# EAGLE design V1 (EAGLE 7.6.0)
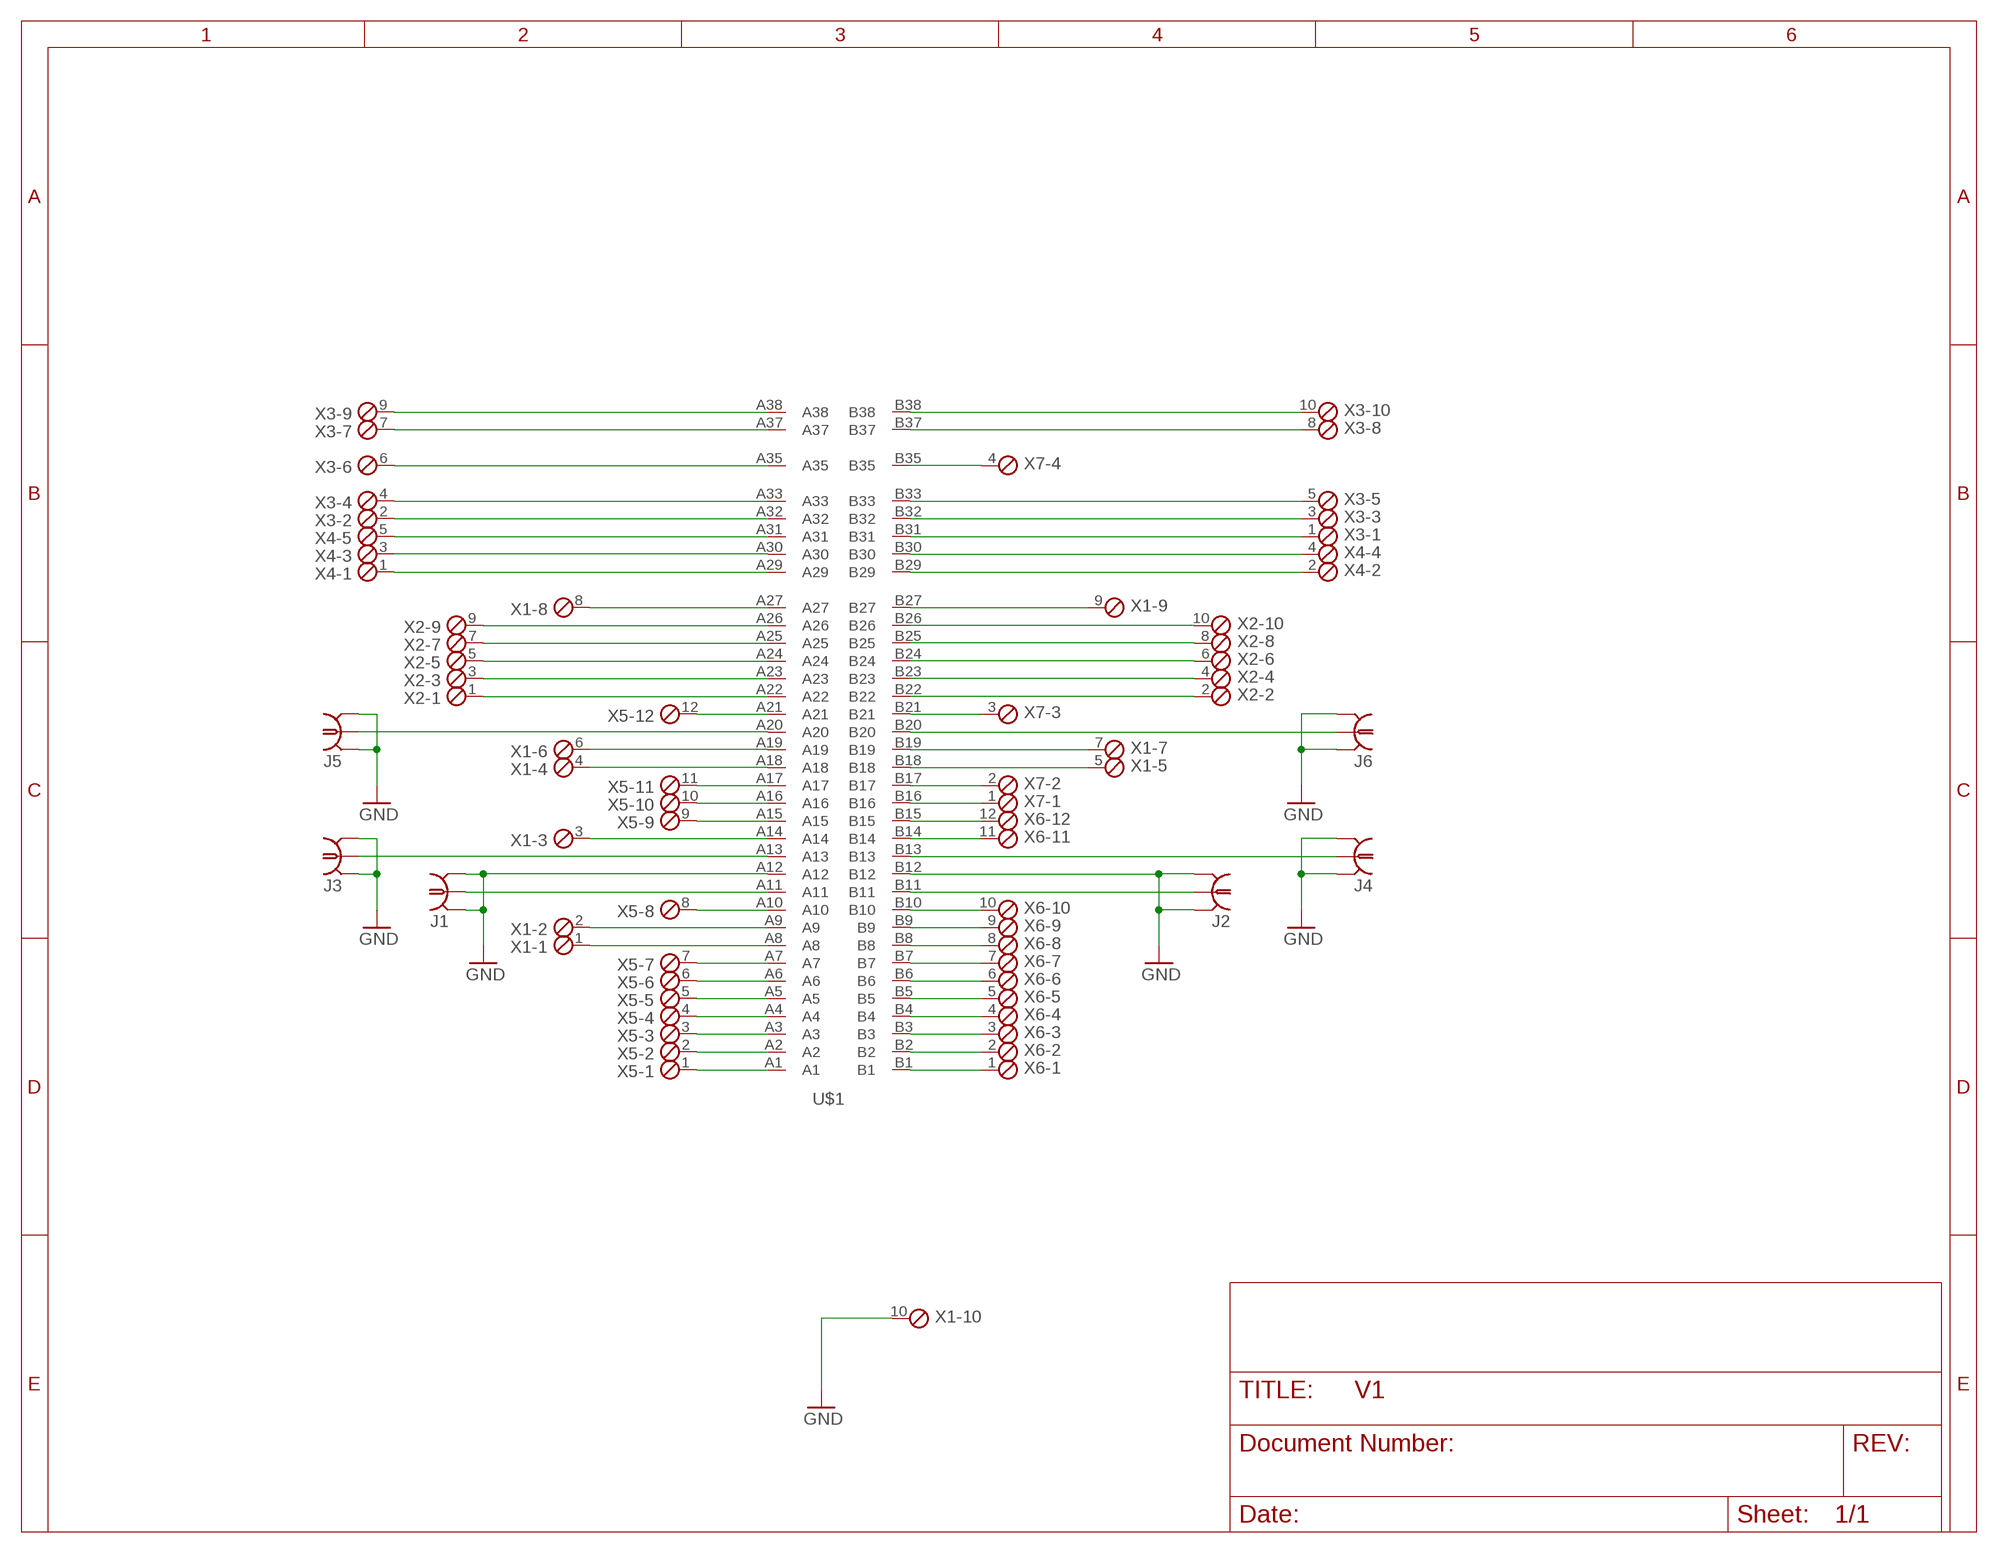
[diagram p0: schematic, sheet 1]

## Parts
J1  BNC_MOLEX_73100  [73100]
J2  BNC_MOLEX_73100  [73100]
J3  BNC_MOLEX_73100  [73100]
J4  BNC_MOLEX_73100  [73100]
J5  BNC_MOLEX_73100  [73100]
J6  BNC_MOLEX_73100  [73100]
U$1  TEK_7000  [TEK_7000]
X1  MPT10  [10POL254]
X2  MPT10  [10POL254]
X3  MPT10  [10POL254]
X4  MPT5  [5POL254]
X5  MPT12  [12POL254]
X6  MPT12  [12POL254]
X7  MPT4  [4POL254]

## Nets
GND: J1.GND J1.GND@1(GND) J2.GND J2.GND@1(GND) J3.GND J3.GND@1(GND) J4.GND J4.GND@1(GND) J5.GND J5.GND@1(GND) J6.GND J6.GND@1(GND) U$1.A12 U$1.B12 X1.10
N$1: U$1.A1 X5.1
N$2: U$1.A2 X5.2
N$3: U$1.A3 X5.3
N$4: U$1.A4 X5.4
N$5: U$1.A5 X5.5
N$6: U$1.A6 X5.6
N$7: U$1.A7 X5.7
N$8 [Power]: U$1.A8 X1.1
N$9 [Power]: U$1.A9 X1.2
N$10: U$1.A10 X5.8
N$11 [50Ohm]: J1.SIG U$1.A11
N$12 [50Ohm]: J3.SIG U$1.A13
N$13 [Power]: U$1.A14 X1.3
N$14: U$1.A15 X5.9
N$15: U$1.A16 X5.10
N$16: U$1.A17 X5.11
N$17: U$1.B1 X6.1
N$18: U$1.B2 X6.2
N$19: U$1.B3 X6.3
N$20: U$1.B4 X6.4
N$21: U$1.B5 X6.5
N$22: U$1.B6 X6.6
N$23: U$1.B7 X6.7
N$24: U$1.B8 X6.8
N$25: U$1.B9 X6.9
N$26: U$1.B10 X6.10
N$27 [50Ohm]: J2.SIG U$1.B11
N$28 [50Ohm]: J4.SIG U$1.B13
N$29: U$1.B14 X6.11
N$30: U$1.B15 X6.12
N$31: U$1.B16 X7.1
N$32: U$1.B17 X7.2
N$33 [Power]: U$1.B18 X1.5
N$34 [Power]: U$1.B19 X1.7
N$35 [Power]: U$1.A18 X1.4
N$36 [Power]: U$1.A19 X1.6
N$37 [50Ohm]: J6.SIG U$1.B20
N$38 [50Ohm]: J5.SIG U$1.A20
N$39: U$1.A21 X5.12
N$40: U$1.B21 X7.3
N$41 [Power]: U$1.A27 X1.8
N$42 [Power]: U$1.B27 X1.9
N$43: U$1.A26 X2.9
N$44: U$1.A25 X2.7
N$45: U$1.A24 X2.5
N$46: U$1.A23 X2.3
N$47: U$1.A22 X2.1
N$48: U$1.B26 X2.10
N$49: U$1.B25 X2.8
N$50: U$1.B24 X2.6
N$51: U$1.B23 X2.4
N$52: U$1.B22 X2.2
N$53: U$1.B35 X7.4
N$54: U$1.A29 X4.1
N$55: U$1.A30 X4.3
N$56: U$1.A31 X4.5
N$57: U$1.A32 X3.2
N$58: U$1.A33 X3.4
N$59: U$1.A35 X3.6
N$60: U$1.A37 X3.7
N$61: U$1.A38 X3.9
N$62: U$1.B38 X3.10
N$63: U$1.B37 X3.8
N$64: U$1.B31 X3.1
N$65: U$1.B32 X3.3
N$66: U$1.B33 X3.5
N$67: U$1.B30 X4.4
N$68: U$1.B29 X4.2

## Library data of the parts
J1-J6 = AndyW:BNC_MOLEX_73100: MOLEX RA PCB mount BNC Origin alignes with board edge.
U$1 = AndyW:TEK_7000: Tek 7000 plug-in connector 76 pin, 0.1", dual-sided. A & B sides, 1-38 each. Omit: [AB][28,34,36] as per manual. Origin aligned to lower left corner of 3.9" high PCB.
X1-X3 = con-phoenix-254:MPT10: PHOENIX CONNECTOR; OC_FARNELL: unknown; OC_NEWARK: unknown
X4 = con-phoenix-254:MPT5: PHOENIX CONNECTOR; OC_FARNELL: unknown; OC_NEWARK: unknown
X5 X6 = con-phoenix-254:MPT12: PHOENIX CONNECTOR; OC_FARNELL: unknown; OC_NEWARK: unknown
X7 = con-phoenix-254:MPT4: PHOENIX CONNECTOR; OC_FARNELL: unknown; OC_NEWARK: unknown

## Net classes
0 default: width 0.203 mm, drill 0.254 mm, clearance 0.152 mm
1 50Ohm: width 0.406 mm, drill 0.254 mm, clearance 0.254 mm
2 Power: width 1.016 mm, drill 0.254 mm, clearance 0.508 mm

## Board
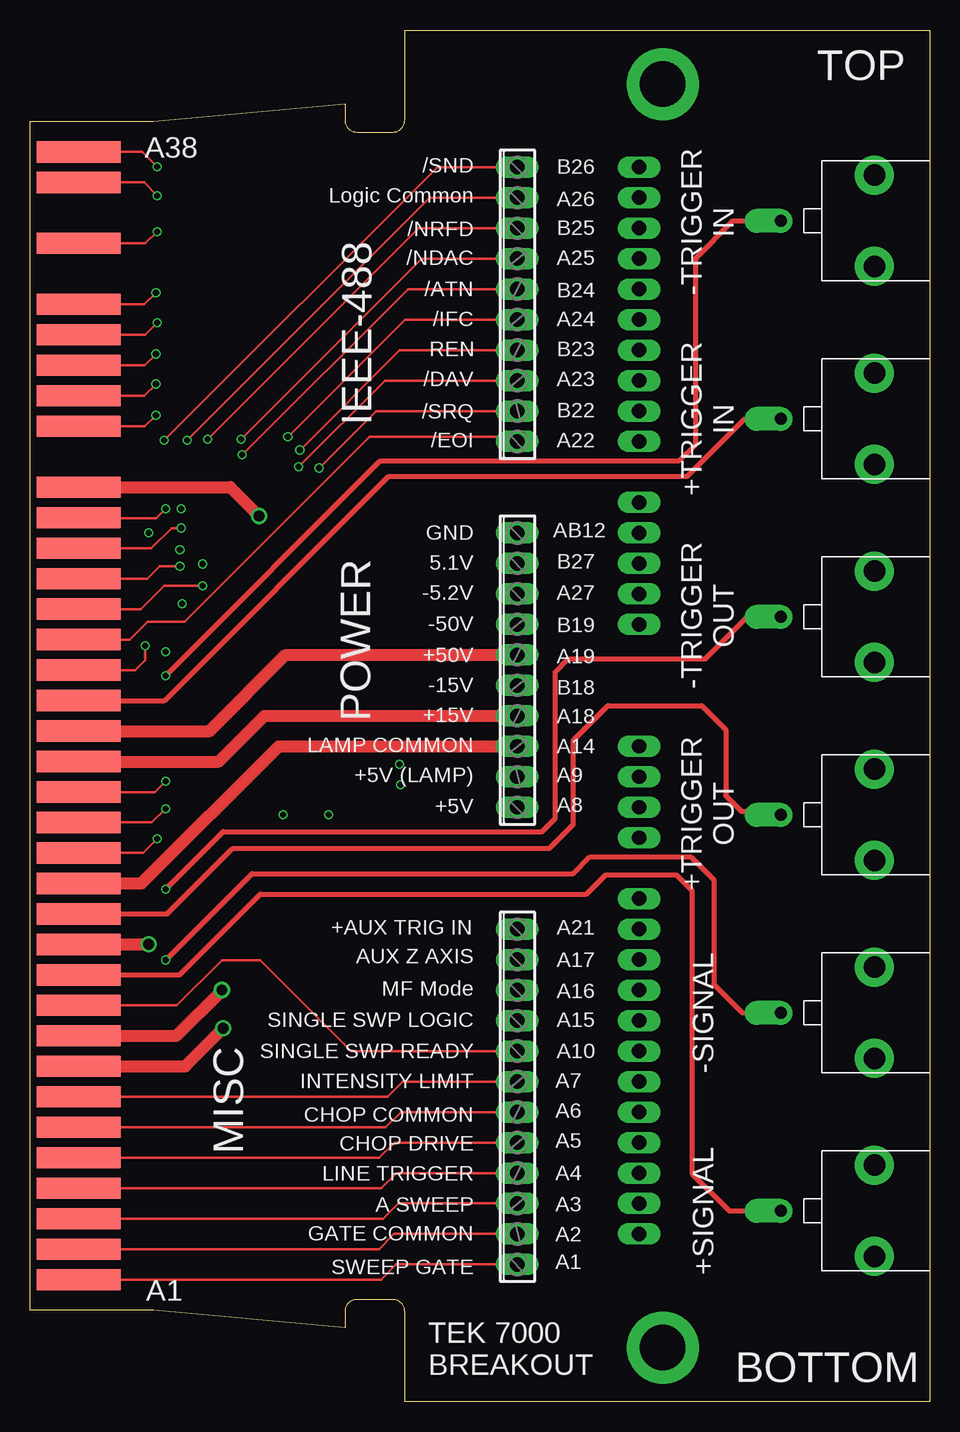
[diagram p1: board, top side]
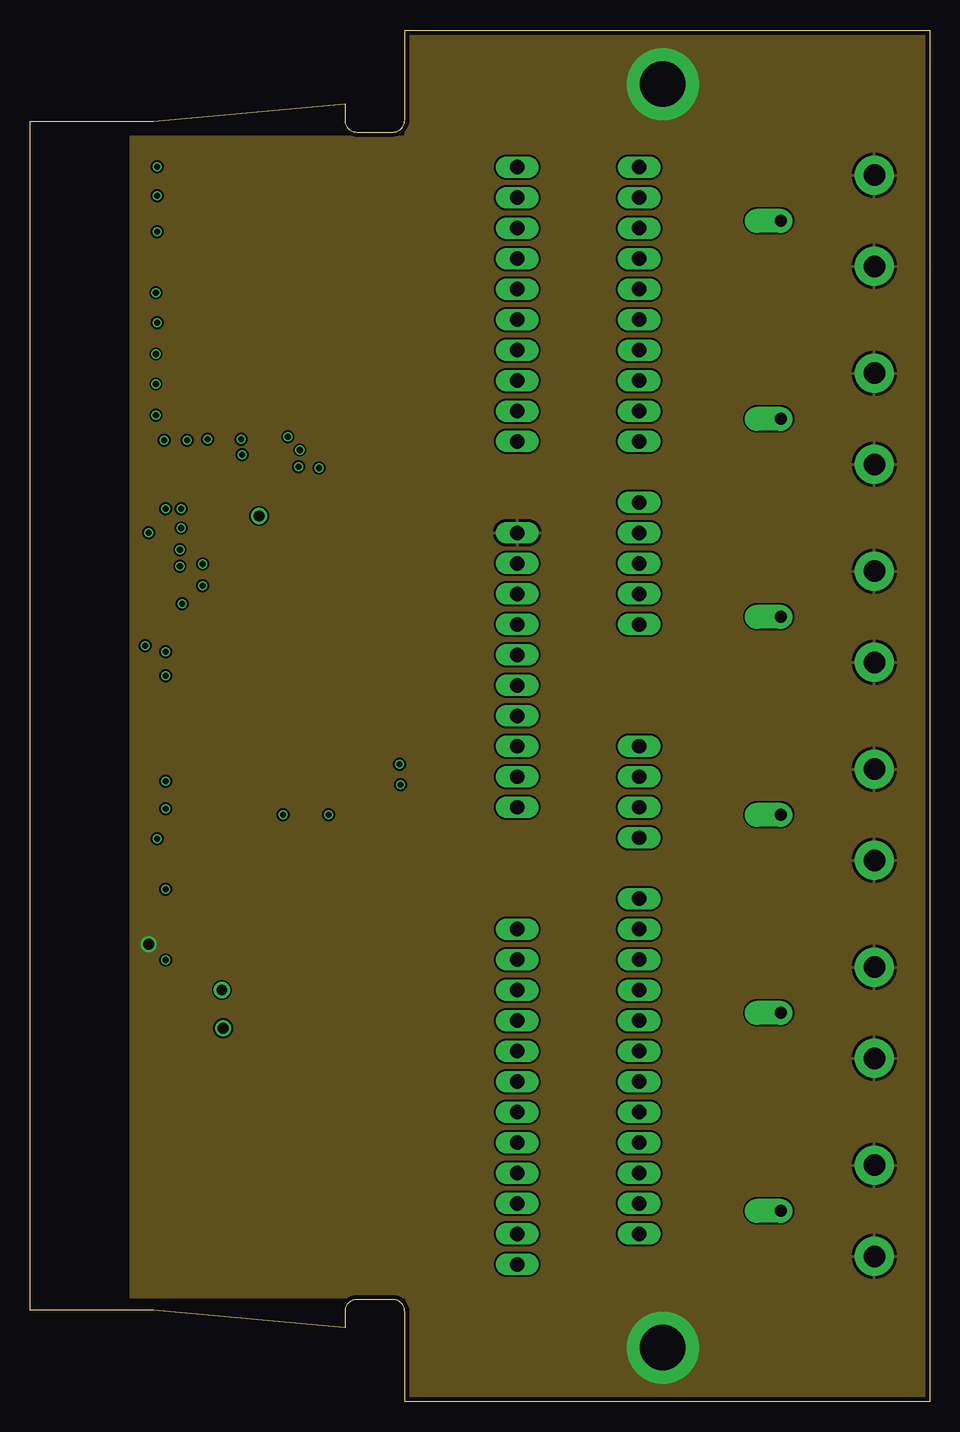
[diagram p2: board, inner layer Route2]
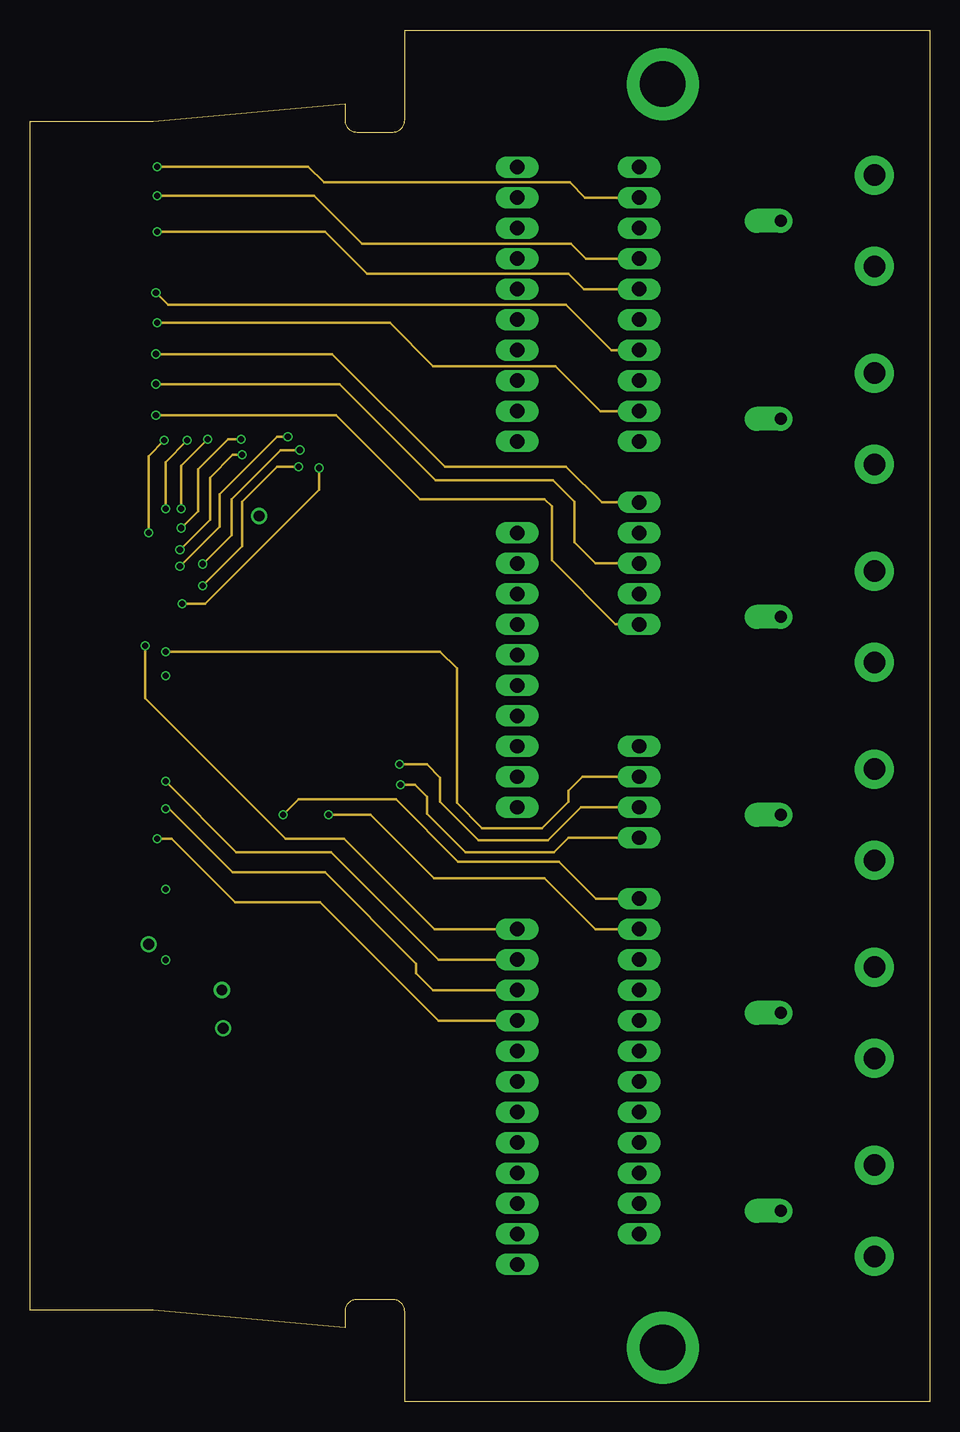
[diagram p3: board, inner layer Route15]
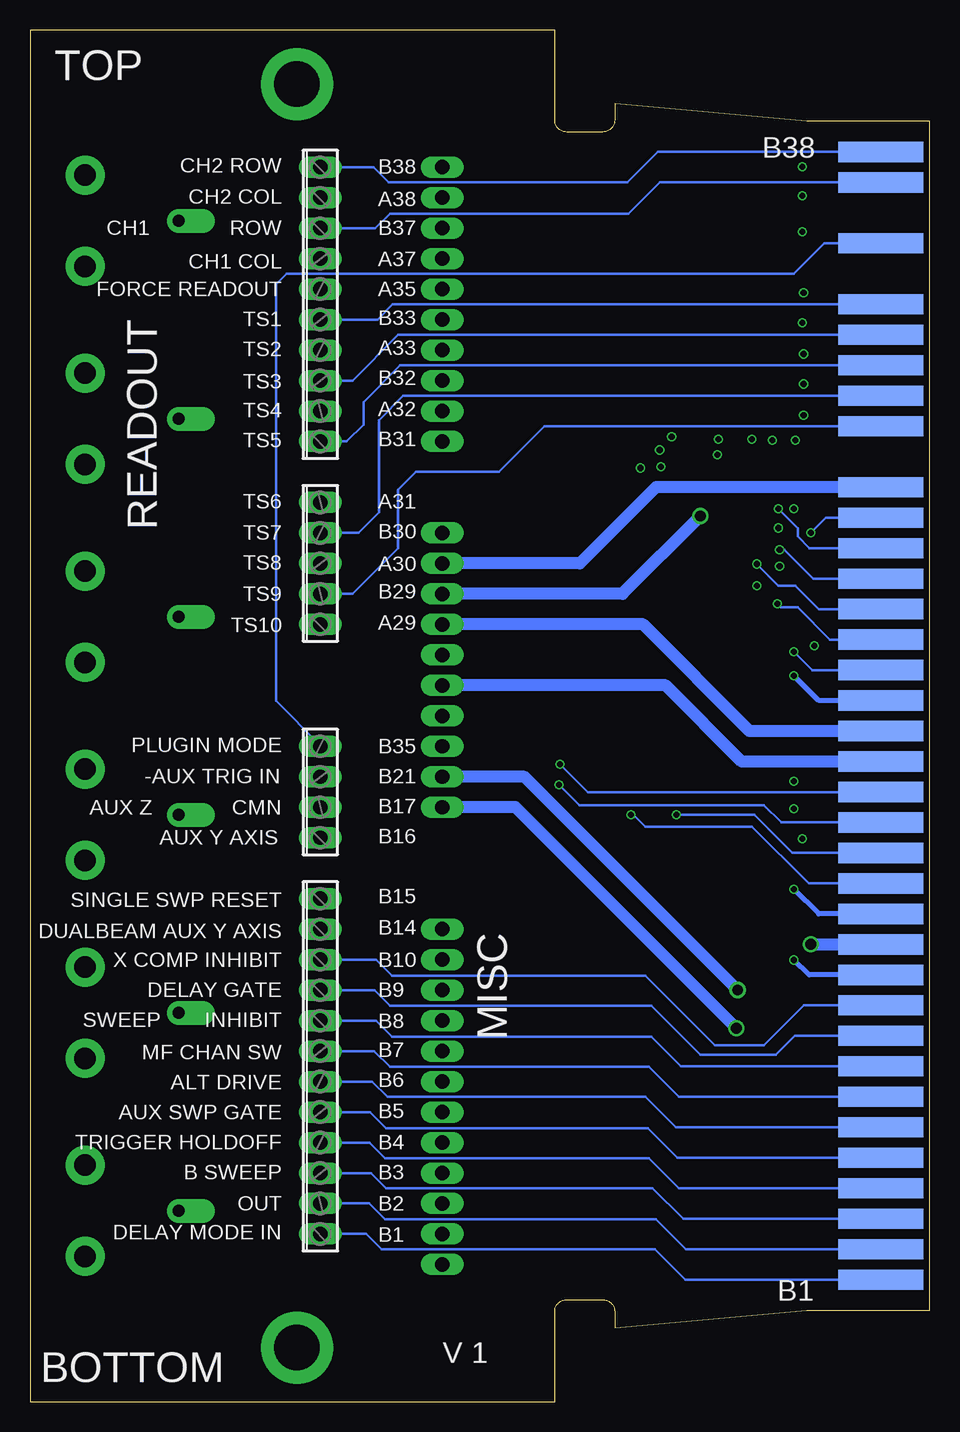
[diagram p4: board, bottom side, seen from below]

Size 75 x 114.3 mm. Coordinates in mm from the lower left corner, seen from the top.
Outline: 0,7.62 0,106.68 10.25,106.68 26.25,108.15 26.25,106.8 arc90 27.25,105.8 30.25,105.8 arc90 31.25,106.8 31.25,114.3 75,114.3 75,0 31.25,0 31.25,7.5 arc90 30.25,8.5 27.25,8.5 arc90 26.25,7.5 26.25,6.15 10.25,7.62 0,7.62
Copper layers (1*2*15*16): Top 0.035559375mm / dielectric 0.17018125mm / Route2 0.01778125mm / dielectric 47mil / Route15 0.01778125mm / dielectric 0.17018125mm / Bottom 0.035559375mm
Design rules "oshpark-4layer": minimum track width 5mil, minimum drill 10mil, track to track 5mil, track to pad 5mil, pad to pad 5mil, via to via 5mil, smd to smd 5mil, copper to edge 15mil, drill to drill 6mil, minimum pad ring 4mil, minimum via ring 4mil, stop-mask expansion 2.5mil, vias tented up to drill 0mil, thermal gap 10mil

### Footprints (pad centres in the part's own frame; a part is rotated, then mirrored left to right if it is on the bottom)
73100 = drill 1.8 pad 3.25: GND -4.6,-3.8; GND@1 -4.6,3.8 | drill 1 pad 2 offset: SIG -12.4,0
TEK_7000 = smd 7.112 x 1.778: A1 4.064,2.54; A2 4.064,5.08; A3 4.064,7.62; A4 4.064,10.16; A5 4.064,12.7; A6 4.064,15.24; A7 4.064,17.78; A8 4.064,20.32; A9 4.064,22.86; A10 4.064,25.4; A11 4.064,27.94; A12 4.064,30.48; A13 4.064,33.02; A14 4.064,35.56; A15 4.064,38.1; A16 4.064,40.64; A17 4.064,43.18; A18 4.064,45.72; A19 4.064,48.26; A20 4.064,50.8; A21 4.064,53.34; A22 4.064,55.88; A23 4.064,58.42; A24 4.064,60.96; A25 4.064,63.5; A26 4.064,66.04; A27 4.064,68.58; A29 4.064,73.66; A30 4.064,76.2; A31 4.064,78.74; A32 4.064,81.28; A33 4.064,83.82; A35 4.064,88.9; A37 4.064,93.98; A38 4.064,96.52 | smd 7.112 x 1.778 bottom: B1 4.064,2.54; B2 4.064,5.08; B3 4.064,7.62; B4 4.064,10.16; B5 4.064,12.7; B6 4.064,15.24; B7 4.064,17.78; B8 4.064,20.32; B9 4.064,22.86; B10 4.064,25.4; B11 4.064,27.94; B12 4.064,30.48; B13 4.064,33.02; B14 4.064,35.56; B15 4.064,38.1; B16 4.064,40.64; B17 4.064,43.18; B18 4.064,45.72; B19 4.064,48.26; B20 4.064,50.8; B21 4.064,53.34; B22 4.064,55.88; B23 4.064,58.42; B24 4.064,60.96; B25 4.064,63.5; B26 4.064,66.04; B27 4.064,68.58; B29 4.064,73.66; B30 4.064,76.2; B31 4.064,78.74; B32 4.064,81.28; B33 4.064,83.82; B35 4.064,88.9; B37 4.064,93.98; B38 4.064,96.52
10POL254 = drill 1.2 long: 1 -11.43,0; 2 -8.89,0; 3 -6.35,0; 4 -3.81,0; 5 -1.27,0; 6 1.27,0; 7 3.81,0; 8 6.35,0; 9 8.89,0; 10 11.43,0
5POL254 = drill 1.2 long: 1 -5.08,0; 2 -2.54,0; 3 0,0; 4 2.54,0; 5 5.08,0
12POL254 = drill 1.2 long: 1 -13.97,0; 2 -11.43,0; 3 -8.89,0; 4 -6.35,0; 5 -3.81,0; 6 -1.27,0; 7 1.27,0; 8 3.81,0; 9 6.35,0; 10 8.89,0; 11 11.43,0; 12 13.97,0
4POL254 = drill 1.2 long: 1 -3.81,0; 2 -1.27,0; 3 1.27,0; 4 3.81,0

### Placement (x,y rotation side)
J1  75,15.9 0 top
J2  75,32.4 0 top
J3  75,48.9 0 top
J4  75,65.4 0 top
J5  75,81.9 0 top
J6  75,98.4 0 top
U$1  0,7.62 0 top
X1  40.64,60.96 90 top
X2  40.64,91.44 90 top
X3  50.8,91.44 90 bottom
X4  50.8,69.85 90 bottom
X5  40.64,25.4 90 top
X6  50.8,27.94 90 bottom
X7  50.8,50.8 90 bottom

### Tracks (layer width: path | path; a pad name or v marks a point on that pad's centre or on a via)
GND  (via drill 0.9, 3.8 pad 6)
  Top 1.016: U$1.B12 v9.9,38.1
  Bottom 1.016: v9.9,38.1 U$1.B12
  other vias: 52.75,4.5 52.75,109.8
  pour Route2: 8.38,105.41 31.3,105.4 31.3,114.1 74.9,114.1 74.9,0.1 31.4,0.1 31.4,8.7 8.38,8.7
N$1
  Top 0.203: U$1.A1 29.26,10.16 30.53,11.43 X5.1
N$2
  Top 0.203: U$1.A2 29.1,12.7 30.37,13.97 X5.2
N$3
  Top 0.203: U$1.A3 29.44,15.24 30.71,16.51 X5.3
N$4
  Top 0.203: U$1.A4 29.28,17.78 30.55,19.05 X5.4
N$5
  Top 0.203: U$1.A5 29.12,20.32 30.39,21.59 X5.5
N$6
  Top 0.203: U$1.A6 29.66,22.86 30.93,24.13 X5.6
N$7
  Top 0.203: U$1.A7 29.8,25.4 31.07,26.67 X5.7
N$8  (via drill 0.9)
  Top 1.016: U$1.A8 12.94,27.94 v16.1,31.1
  Bottom 1.016: v16.1,31.1 34.53,49.53 X1.1
N$9  (via drill 0.9)
  Top 1.016: U$1.A9 12.18,30.48 v16,34.3
  Bottom 1.016: v16,34.3 33.77,52.07 X1.2
N$10
  Top 0.203: U$1.A10 12.22,33.02 16,36.8 19.2,36.8 26.79,29.21 X5.8
N$11
  Top 0.406: U$1.A11 12.46,35.56 19.2,42.3 46.4,42.3 48,43.9 53.9,43.9 55.2,42.6 55.2,19 58.3,15.9 J1.SIG
N$12
  Top 0.406: U$1.A13 11.44,40.64 16.9,46.1 43.3,46.1 45.3,48.1 45.3,55.1 48.2,58 56,58 58,56 58,50.5 59.3,49.2 62.3,49.2 J3.SIG
N$13
  Top 1.016: U$1.A14 9.28,43.18 20.71,54.61 X1.3
N$14  (via drill 0.51)
  Top 0.203: U$1.A15 9.42,45.72 v10.6,46.9
  Route15 0.203: v10.6,46.9 11.8,46.9 17.1,41.6 24.2,41.6 34.05,31.75 X5.9
N$15  (via drill 0.51)
  Top 0.203: U$1.A16 10.16,48.26 v11.3,49.4
  Route15 0.203: v11.3,49.4 11.6,49.4 16.9,44.1 24.6,44.1 32.2,36.5 32.2,35.7 33.61,34.29 X5.10
N$16  (via drill 0.51)
  Top 0.203: U$1.A17 10.4,50.8 v11.3,51.7
  Route15 0.203: v11.3,51.7 17.2,45.8 25.1,45.8 34.07,36.83 X5.11
N$17
  Bottom 0.203: U$1.B1 20.36,10.16 22.9,12.7 45.7,12.7 46.97,13.97 X6.1
N$18
  Bottom 0.203: U$1.B2 20.3,12.7 22.8,15.2 45.4,15.2 46.71,16.51 X6.2
N$19
  Bottom 0.203: U$1.B3 20.54,15.24 23.1,17.8 45.3,17.8 46.55,19.05 X6.3
N$20
  Bottom 0.203: U$1.B4 20.88,17.78 23.4,20.3 45.4,20.3 46.69,21.59 X6.4
N$21
  Bottom 0.203: U$1.B5 21.02,20.32 23.5,22.8 45.3,22.8 46.63,24.13 X6.5
N$22
  Bottom 0.203: U$1.B6 21.16,22.86 23.7,25.4 45.2,25.4 46.47,26.67 X6.6
N$23
  Bottom 0.203: U$1.B7 20.9,25.4 23.4,27.9 45,27.9 46.31,29.21 X6.7
N$24
  Bottom 0.203: U$1.B8 20.74,27.94 23.2,30.4 44.8,30.4 46.15,31.75 X6.8
N$25
  Bottom 0.203: X6.9 46.29,34.29 45,33 23.2,33 19.1,28.9 12.8,28.9 11.22,30.48 U$1.B9
N$26
  Bottom 0.203: U$1.B10 10.48,33.02 13.8,29.7 17.9,29.7 23.7,35.5 44.8,35.5 46.13,36.83 X6.10
N$27  (via drill 0.51)
  Top 0.406: v11.3,36.8 18.5,44 45.3,44 46.7,45.4 55.1,45.4 57,43.5 57,34.8 59.4,32.4 J2.SIG
  Bottom 0.406: U$1.B11 10.06,35.56 v11.3,36.8
N$28  (via drill 0.51)
  Top 0.406: v11.3,42.7 16.1,47.5 42.7,47.5 43.8,48.6 43.8,60.8 44.9,61.9 56.3,61.9 59.8,65.4 J4.SIG
  Bottom 0.406: U$1.B13 9.24,40.64 v11.3,42.7
N$29  (via drill 0.51)
  Route15 0.203: v24.9,48.9 28.4,48.9 33.7,43.6 42.9,43.6 47.13,39.37 X6.11
  Bottom 0.203: U$1.B14 10.08,43.18 14.8,47.9 23.7,47.9 24.7,48.9 v24.9,48.9
N$30  (via drill 0.51)
  Route15 0.203: X6.12 47.19,41.91 44.1,45 35.7,45 30.5,50.2 22.4,50.2 v21.1,48.9
  Bottom 0.203: U$1.B15 11.42,45.72 14.6,48.9 v21.1,48.9
N$31  (via drill 0.51)
  Route15 0.203: v30.9,51.4 32.1,51.4 33.1,50.4 33.1,49 36.3,45.8 43.7,45.8 44.89,46.99 X7.1
  Bottom 0.203: U$1.B16 12.36,48.26 13.8,49.7 29.2,49.7 v30.9,51.4
N$32  (via drill 0.51)
  Route15 0.203: v30.8,53.1 33.1,53.1 34.2,52 34.2,50 37.4,46.8 43.2,46.8 45.93,49.53 X7.2
  Bottom 0.203: U$1.B17 28.5,50.8 v30.8,53.1
N$33
  Bottom 1.016: U$1.B18 15.64,53.34 21.99,59.69 X1.5
N$34
  Bottom 1.016: U$1.B19 14.98,55.88 23.87,64.77 X1.7
N$35
  Top 1.016: U$1.A18 15.74,53.34 19.55,57.15 X1.4
N$36
  Top 1.016: U$1.A19 14.98,55.88 21.33,62.23 X1.6
N$37  (via drill 0.51)
  Top 0.406: v11.3,60.5 29.2,78.4 54.1,78.4 55.5,79.8 55.5,95.3 58.6,98.4 J6.SIG
  Bottom 0.406: U$1.B20 9.22,58.42 v11.3,60.5
N$38
  Top 0.406: U$1.A20 11.22,58.42 29.9,77.1 54.8,77.1 59.6,81.9 J5.SIG
N$39  (via drill 0.51)
  Top 0.203: U$1.A21 8.76,60.96 9.6,61.8 v9.6,63
  Route15 0.203: v9.6,63 9.6,58.6 21.3,46.9 26.2,46.9 33.73,39.37 X5.12
N$40  (via drill 0.51)
  Route15 0.203: v11.3,62.5 34.2,62.5 35.6,61.1 35.6,49.9 37.7,47.8 42.7,47.8 44.9,50 44.9,50.9 46.07,52.07 X7.3
  Bottom 0.203: U$1.B21 9.76,60.96 v11.3,62.5
N$41  (via drill 0.9)
  Top 1.016: U$1.A27 16.7,76.2 v19.1,73.8
  Bottom 1.016: v19.1,73.8 25.59,67.31 X1.8
N$42
  Bottom 1.016: U$1.B27 22.8,76.2 29.15,69.85 X1.9
N$43  (via drill 0.51)
  Top 0.203: v13.1,80.1 33.33,100.33 X2.9 | v11.3,74.4 10.5,73.6 3.5,73.6 3.56,73.66 U$1.A26
  Route15 0.203: v13.1,80.1 11.3,78.3 v11.3,74.4
N$44  (via drill 0.51)
  Top 0.203: U$1.A25 10.12,71.12 11.8,72.8 v12.6,72.8 | v17.6,80.2 32.65,95.25 X2.7
  Route15 0.203: v12.6,72.8 14,74.2 14,77.7 16.5,80.2 v17.6,80.2
N$45  (via drill 0.51)
  Top 0.203: U$1.A24 9.78,68.58 10.8,69.6 v12.5,69.6 | v21.5,80.4 31.27,90.17 X2.5
  Route15 0.203: v12.5,69.6 15.8,72.9 15.8,75.6 20.6,80.4 v21.5,80.4
N$46  (via drill 0.51)
  Top 0.203: U$1.A23 9.24,66.04 11.2,68 v14.4,68 | v22.4,77.9 29.59,85.09 X2.3
  Route15 0.203: v14.4,68 17.7,71.3 17.7,75 20.6,77.9 v22.4,77.9
N$47
  Top 0.203: U$1.A22 8.3,63.5 9.8,65 12.9,65 28.3,80.4 40.25,80.4 arc-90 X2.1
N$48  (via drill 0.51)
  Top 0.203: v11.2,80.1 33.97,102.87 X2.10
  Route15 0.203: v9.9,72.4 9.9,78.8 v11.2,80.1
  Bottom 0.203: U$1.B26 8.64,73.66 v9.9,72.4
N$49  (via drill 0.51)
  Top 0.203: v14.8,80.2 32.39,97.79 X2.8
  Route15 0.203: v12.6,74.4 12.6,78 v14.8,80.2
  Bottom 0.203: U$1.B25 10.02,71.12 11,72.1 11,72.8 v12.6,74.4
N$50  (via drill 0.51)
  Top 0.203: v17.7,78.9 31.51,92.71 X2.6
  Route15 0.203: v12.5,71 15,73.5 15,77 16.9,78.9 v17.7,78.9
  Bottom 0.203: U$1.B24 9.68,68.58 12.1,71 v12.5,71
N$51  (via drill 0.51)
  Top 0.203: v22.5,79.3 30.83,87.63 X2.4
  Route15 0.203: v14.4,69.8 16.8,72.2 16.8,75.2 20.9,79.3 v22.5,79.3
  Bottom 0.203: U$1.B23 9.24,66.04 11.2,68 12.6,68 v14.4,69.8
N$52  (via drill 0.51)
  Top 0.203: v24.1,77.8 28.85,82.55 X2.2
  Route15 0.203: 24,77.8 v24.1,77.8 24.1,76 14.6,66.5 v12.7,66.5
  Bottom 0.203: U$1.B22 8.3,63.5 11,66.2 12.4,66.2 v12.7,66.5
N$53
  Bottom 0.203: U$1.B35 8.78,96.52 11.3,94 53.6,94 54.5,93.1 54.5,58.4 50.8,54.7 X7.4
N$54  (via drill 0.51)
  Top 0.203: U$1.A29 9.58,81.28 v10.5,82.2
  Route15 0.203: v10.5,82.2 25.5,82.2 32.5,75.2 42.9,75.2 43.5,74.6 43.5,70.1 48.83,64.77 X4.1
N$55  (via drill 0.51)
  Top 0.203: U$1.A30 9.52,83.82 v10.5,84.8
  Route15 0.203: v10.5,84.8 25.8,84.8 33.8,76.8 43.6,76.8 45.4,75 45.4,71.6 47.15,69.85 X4.3
N$56  (via drill 0.51)
  Top 0.203: U$1.A31 9.56,86.36 v10.5,87.3
  Route15 0.203: v10.5,87.3 25.2,87.3 34.6,77.9 44.7,77.9 47.67,74.93 X4.5
N$57  (via drill 0.51)
  Top 0.203: U$1.A32 9.6,88.9 v10.6,89.9
  Route15 0.203: v10.6,89.9 30,89.9 33.6,86.3 43.8,86.3 47.55,82.55 X3.2
N$58  (via drill 0.51)
  Top 0.203: U$1.A33 9.54,91.44 v10.5,92.4
  Route15 0.203: v10.5,92.4 11.5,91.4 44.7,91.4 48.47,87.63 X3.4
N$59  (via drill 0.51)
  Top 0.203: U$1.A35 9.62,96.52 v10.6,97.5
  Route15 0.203: v10.6,97.5 24.6,97.5 28.1,94 44.9,94 46.19,92.71 X3.6
N$60  (via drill 0.51)
  Top 0.203: U$1.A37 9.5,101.6 v10.6,100.5
  Route15 0.203: v10.6,100.5 23.7,100.5 27.7,96.5 45.1,96.5 46.35,95.25 X3.7
N$61  (via drill 0.51)
  Top 0.203: U$1.A38 9.36,104.14 v10.6,102.9
  Route15 0.203: v10.6,102.9 23.2,102.9 24.5,101.6 45,101.6 46.27,100.33 X3.9
N$62
  Bottom 0.203: U$1.B38 22.66,104.14 25.2,101.6 45.1,101.6 46.37,102.87 X3.10
N$63
  Bottom 0.203: U$1.B37 22.5,101.6 25.1,99 45,99 46.21,97.79 X3.8
N$64
  Bottom 0.203: U$1.B31 44.14,86.36 47.2,83.3 47.2,81.4 48.59,80.01 X3.1
N$65
  Bottom 0.203: U$1.B32 44.3,88.9 48.11,85.09 X3.3
N$66
  Bottom 0.203: U$1.B33 44.76,91.44 46.03,90.17 X3.5
N$67
  Bottom 0.203: U$1.B30 43.88,83.82 45.9,81.8 45.9,74.1 47.61,72.39 X4.4
N$68
  Bottom 0.203: U$1.B29 32.12,81.28 35.9,77.5 42.8,77.5 44.3,76 44.3,71.1 48.09,67.31 X4.2

### Text on the board
tPlace: TOP | A38 | /SND | B26 | Logic Common | A26 | -TRIGGER / IN | IEEE-488 | /NRFD | B25 | /NDAC | A25 | /ATN | B24 | /IFC | A24 | REN | B23 | /DAV | A23 | /SRQ | B22 | +TRIGGER / IN | /EOI | A22 | GND | AB12 | POWER | 5.1V | B27 | -5.2V | A27 | -TRIGGER / OUT | -50V | B19 | +50V | A19 | -15V | B18 | +15V | A18 | LAMP COMMON | A14 | +5V (LAMP) | A9 | +5V | A8 | +TRIGGER / OUT | +AUX TRIG IN | A21 | AUX Z AXIS | A17 | MF Mode | A16 | -SIGNAL | SINGLE SWP LOGIC | A15 | MISC | SINGLE SWP READY | A10 | A7 | INTENSITY LIMIT | A6 | CHOP COMMON | A5 | CHOP DRIVE | A4 | LINE TRIGGER | A3 | A SWEEP | +SIGNAL | A2 | GATE COMMON | A1 | SWEEP GATE | A1 | TEK 7000 / BREAKOUT | BOTTOM
bPlace: TOP | B38 | B38 | CH2 ROW | A38 | CH2 COL | B37 | ROW | CH1 | A37 | CH1 COL | A35 | FORCE READOUT | B33 | TS1 | READOUT | A33 | TS2 | B32 | TS3 | A32 | TS4 | B31 | TS5 | A31 | TS6 | B30 | TS7 | A30 | TS8 | B29 | TS9 | A29 | TS10 | B35 | PLUGIN MODE | B21 | -AUX TRIG IN | B17 | CMN | AUX Z | B16 | AUX Y AXIS | B15 | SINGLE SWP RESET | MISC | B14 | DUALBEAM AUX Y AXIS | B10 | X COMP INHIBIT | B9 | DELAY GATE | B8 | INHIBIT | SWEEP | B7 | MF CHAN SW | B6 | ALT DRIVE | B5 | AUX SWP GATE | B4 | TRIGGER HOLDOFF | B3 | B SWEEP | B2 | OUT | DELAY MODE IN | B1 | B1 | V 1 | BOTTOM